# EAGLE design flyght (EAGLE 7.7.0)
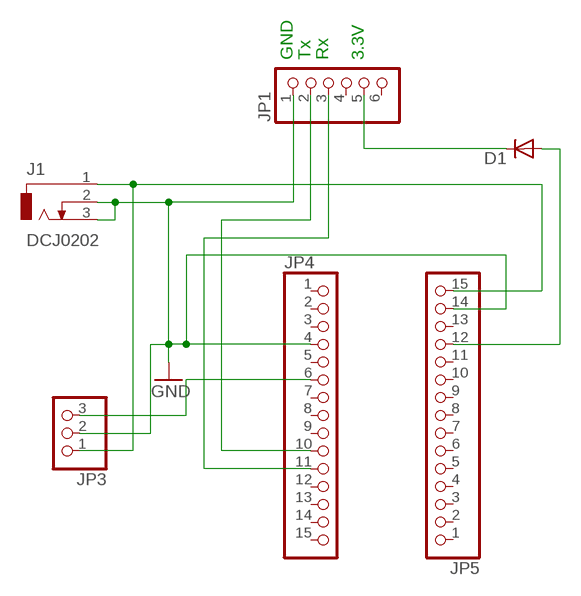
[diagram p0: schematic, sheet 1]

## Parts
D1  1N4004  [DO41-10]
J1  DCJ0202  [DCJ0202]
JP1  PINHD-1X6  [1X06]
JP3  PINHD-1X3  [1X03]
JP4  PINHD-1X15  [1X15]
JP5  PINHD-1X15  [1X15]

## Nets
GND: J1.2 J1.3 JP1.1 JP3.2 JP4.4 JP5.14
LED_DATA: JP3.3 JP4.6
N$2: D1.C JP1.5
N$3: D1.A JP5.12
N$4: JP1.3 JP4.11
N$5: JP1.2 JP4.10
VCC: J1.1 JP3.1 JP5.15
Unconnected: JP1.4 JP1.6 JP4.1 JP4.2 JP4.3 JP4.5 JP4.7 JP4.8 JP4.9 JP4.12 JP4.13 JP4.14 JP4.15 JP5.1 JP5.2 JP5.3 JP5.4 JP5.5 JP5.6 JP5.7 JP5.8 JP5.9 JP5.10 JP5.11 JP5.13

## Notes on the sheet
- GND | Tx | Rx | 3.3V

## Library data of the parts
D1 = adafruit:1N4004: DIODE General purpose 1N400x type rectifier (With bigger pads) http://www.ladyada.net/library/pcb/eaglelibrary.html
J1 = con-jack:DCJ0202: DC POWER JACK Source: DCJ0202.pdf; OC_FARNELL: unknown; OC_NEWARK: unknown
JP1 = pinhead:PINHD-1X6: PIN HEADER
JP3 = pinhead:PINHD-1X3: PIN HEADER
JP4 JP5 = pinhead:PINHD-1X15: PIN HEADER

## Board
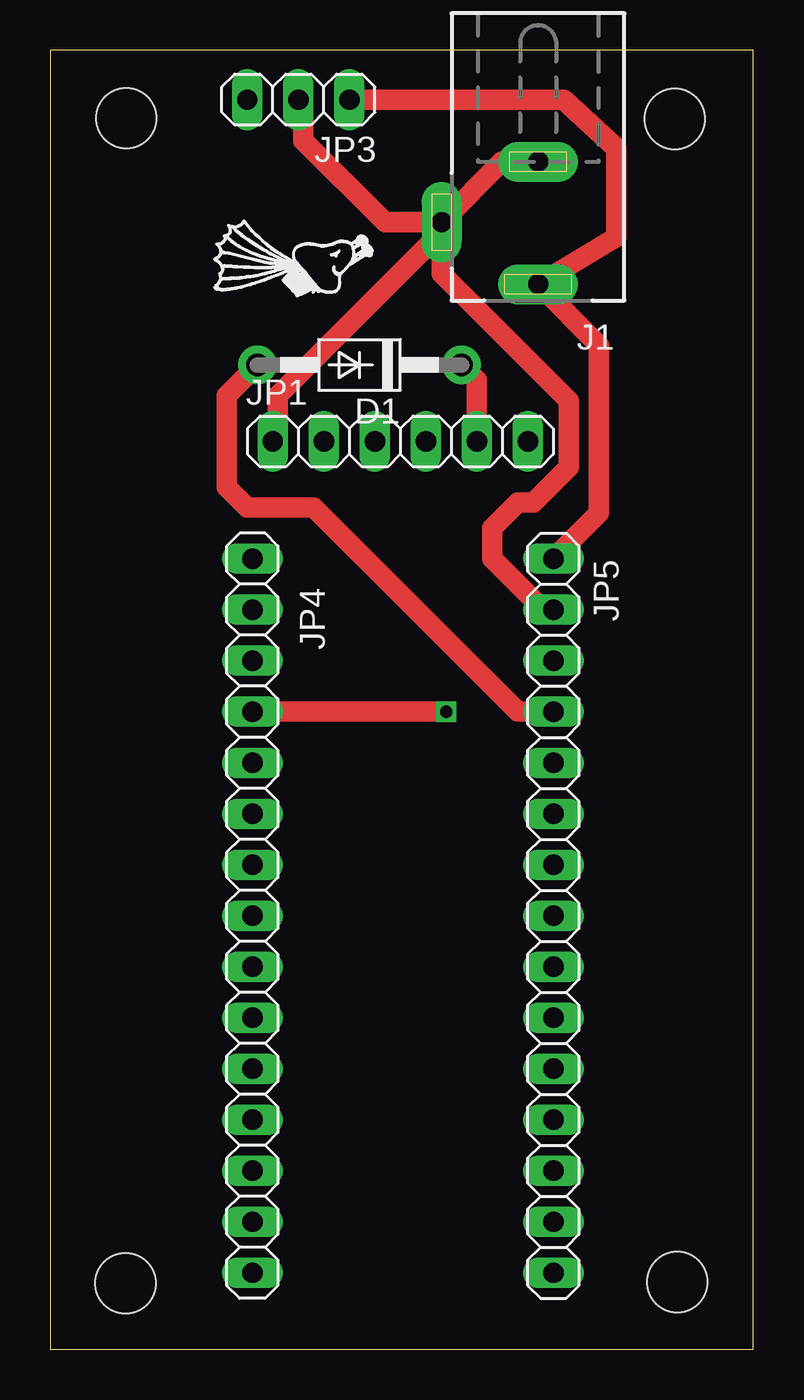
[diagram p1: board, top side]
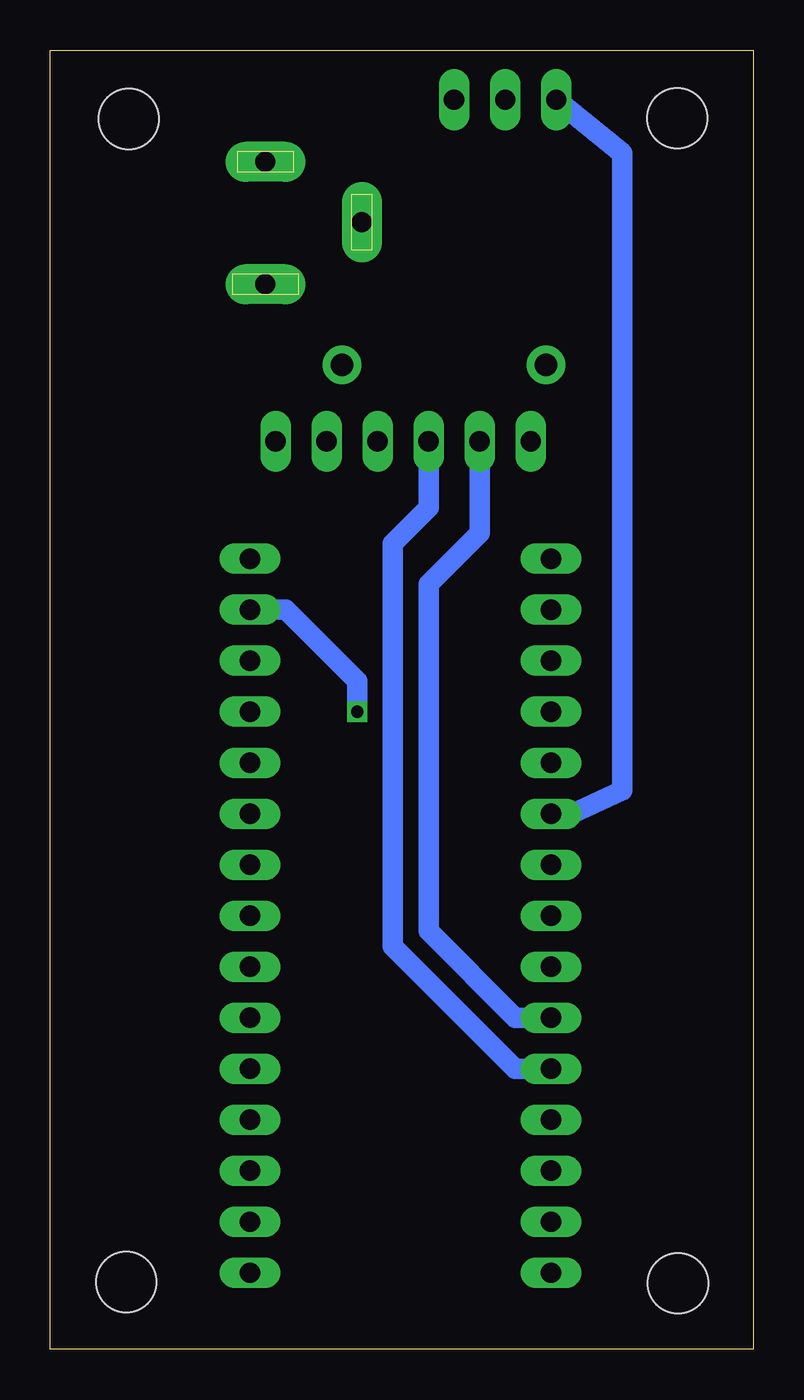
[diagram p2: board, bottom side, seen from below]

Size 35 x 64.69 mm. Coordinates in mm from the lower left corner, seen from the top.
Outline: 0,0 35,0 34.99,64.69 0,64.69 0,0
Copper layers (1*16): Top 0.035mm / dielectric 1.5mm / Bottom 0.035mm
Design rules "default": minimum track width 10mil, minimum drill 24mil, track to track 8mil, track to pad 8mil, pad to pad 8mil, via to via 8mil, smd to smd 8mil, copper to edge 40mil, drill to drill 8mil, minimum pad ring 10mil, minimum via ring 8mil, stop-mask expansion 4mil, vias tented up to drill 0mil, thermal gap 10mil
Holes 3 mm at 3.75,3.29 31.21,3.35 31.09,61.27 3.78,61.31

### Footprints (pad centres in the part's own frame; a part is rotated, then mirrored left to right if it is on the bottom)
DO41-10 = drill 1.118 pad 1.93: A 5.08,0; C -5.08,0
DCJ0202 = drill 1 pad 2 long: 1 0,3.1; 2 4.8,0; 3 0,-3
1X06 = drill 1.016 long: 1 -6.35,0; 2 -3.81,0; 3 -1.27,0; 4 1.27,0; 5 3.81,0; 6 6.35,0
1X03 = drill 1.016 long: 1 -2.54,0; 2 0,0; 3 2.54,0
1X15 = drill 1.016 long: 1 -17.78,0; 2 -15.24,0; 3 -12.7,0; 4 -10.16,0; 5 -7.62,0; 6 -5.08,0; 7 -2.54,0; 8 0,0; 9 2.54,0; 10 5.08,0; 11 7.62,0; 12 10.16,0; 13 12.7,0; 14 15.24,0; 15 17.78,0

### Placement (x,y rotation side)
D1  15.4,49.02 180 top
J1  24.29,56.13 180 top
JP1  17.43,45.21 0 top
JP3  12.35,62.23 180 top
JP4  10.06,21.59 270 top
JP5  25.05,21.59 90 top

### Tracks (layer width: path | path; a pad name or v marks a point on that pad's centre or on a via)
GND  (via drill 0.6)
  Top 1.016: v19.72,31.75 JP4.4 | J1.2 22.49,59.13 J1.3 | J1.2 19.49,53.57 25.81,47.24 25.81,43.94 24.03,42.16 23.27,42.16 22,40.89 22,39.37 24.54,36.83 JP5.14 | JP1.1 11.33,45.47 11.33,47.5 19.49,55.65 J1.2 | JP3.2 12.6,61.98 12.6,60.2 16.67,56.13 J1.2
  Bottom 1.016: v19.72,31.75 19.72,33.27 23.27,36.83 JP5.14
LED_DATA
  Bottom 1.016: JP4.6 9.05,26.67 6.53,27.82 6.53,59.57 JP3.3
N$2
  Top 1.016: D1.C 21.24,48.26 JP1.5
N$3
  Top 1.016: D1.A 8.79,47.5 8.79,42.93 9.81,41.91 13.11,41.91 23.27,31.75 JP5.12
N$4
  Bottom 1.016: JP4.11 11.84,13.97 17.94,20.07 17.94,40.13 16.16,41.91 JP1.3
N$5
  Bottom 1.016: JP4.10 11.84,16.51 16.16,20.83 16.16,38.1 13.62,40.64 JP1.2
VCC
  Top 1.016: JP5.15 27.32,41.64 27.32,50.01 J1.1 28.18,55.39 28.18,59.8 25.56,62.23 JP3.1